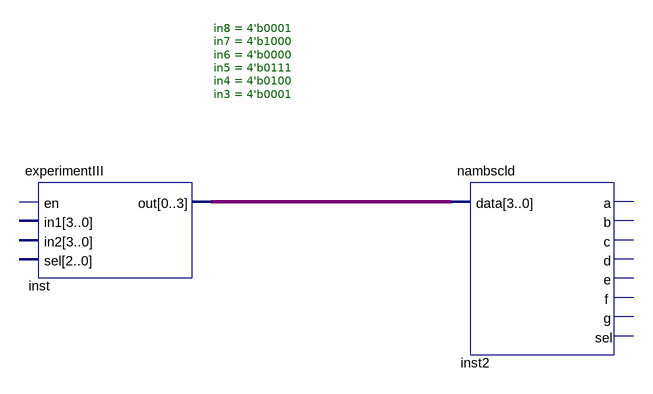
[diagram p0: schematic sheet]
// Quartus schematic experimentIII.bdf as structural Verilog: 2 symbols, 0 pins
module experimentIII (
);

  wire [3:0] inst_out;

  experimentIII #(.in8(4'b0001), .in7(4'b1000), .in6(4'b0000), .in5(4'b0111), .in4(4'b0100), .in3(4'b0001)) inst (.out(inst_out));  // open: en, in1, in2, sel
  nambscld inst2 (.data(inst_out));  // open: a, b, c, d, e, f, g, sel
endmodule
